# Altium schematic sheet MezzanineDCDC_4646.SchDoc: Mezzanine DCDC PCB LTM4646
size Tabloid; Date: 9/7/2021; Engineer: J. Juneau; Organization: Altium Limited; Address1: L3, 12a Rodborough Rd; Address2: Frenchs Forest; Address3: NSW; Address4: Australia 2086; DocumentNumber: 1006; Revision: 1.2; SheetNumber: 2; SheetTotal: 4
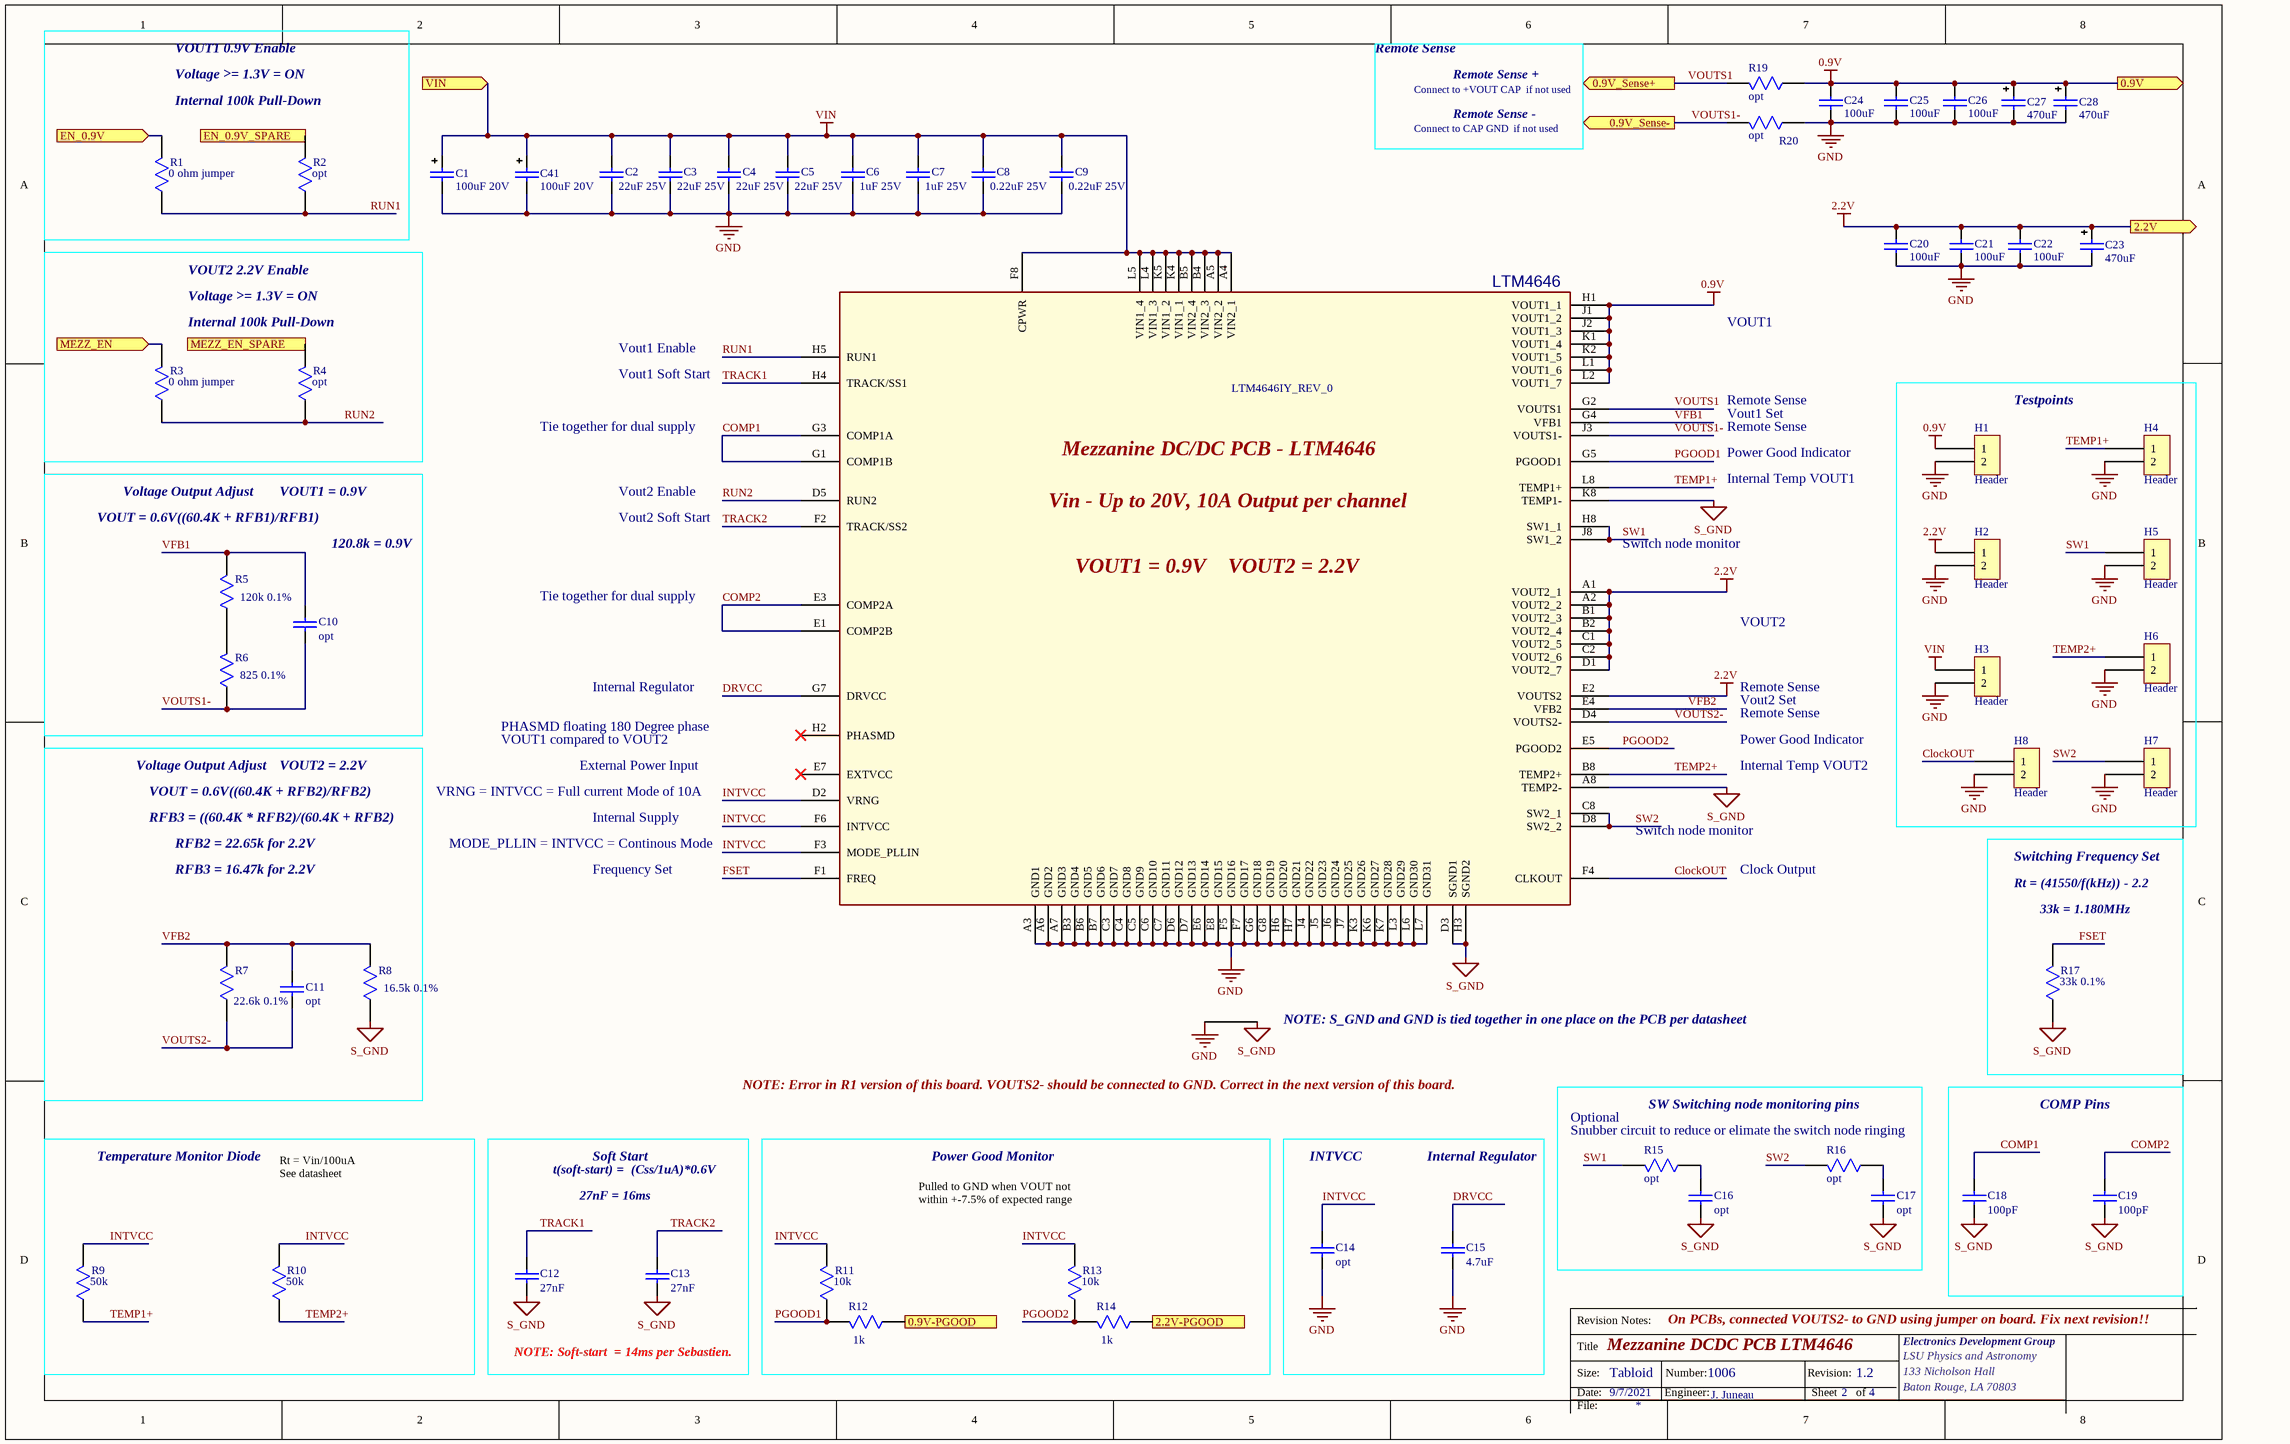
[diagram p0: MezzanineDCDC_4646.SchDoc]

## Parts
C1  value 100uF 20V  [CAP 2917 Tantalum Polarized TAJE107K020RNJ]  (hidden comment: TAJE107K020RNJ)
C2  value 22uF 25V  [CAP 1210 Murata]  (hidden comment: GRM32ER61E226KE15L)
C3  value 22uF 25V  [CAP 1210 Murata]  (hidden comment: GRM32ER61E226KE15L)
C4  value 22uF 25V  [CAP 1210 Murata]  (hidden comment: GRM32ER61E226KE15L)
C5  value 22uF 25V  [CAP 1210 Murata]  (hidden comment: GRM32ER61E226KE15L)
C6  value 1uF 25V  [Cap 0603 TDK]  (hidden comment: GCM188R71E105KA64D)
C7  value 1uF 25V  [Cap 0603 TDK]  (hidden comment: GCM188R71E105KA64D)
C8  value 0.22uF 25V  [Cap 0603 TDK]  (hidden comment: C1608X7R1E224K080AC)
C9  value 0.22uF 25V  [Cap 0603 TDK]  (hidden comment: C1608X7R1E224K080AC)
C10  opt  [Cap 0603 TDK]
C11  opt  [Cap 0603 TDK]
C12  value 27nF  [Cap 0603 TDK]  (hidden comment: 0603YC273KAT2A)
C13  value 27nF  [Cap 0603 TDK]  (hidden comment: 0603YC273KAT2A)
C14  value opt  [Cap 0603 TDK]  (hidden comment: C1608X5R1C475K080AC)
C15  value 4.7uF  [Cap 0603 TDK]  (hidden comment: C1608X5R1C475K080AC)
C16  opt  [Cap 0603 TDK]
C17  opt  [Cap 0603 TDK]
C18  value 100pF  [Cap 0603 TDK]  (hidden comment: 0603YC101KAT2A)
C19  value 100pF  [Cap 0603 TDK]  (hidden comment: 0603YC101KAT2A)
C20  value 100uF  [CAP 1210 Murata]  (hidden comment: GRM32ER60J107ME20K)
C21  value 100uF  [CAP 1210 Murata]  (hidden comment: GRM32ER60J107ME20K)
C22  value 100uF  [CAP 1210 Murata]  (hidden comment: GRM32ER60J107ME20K)
C23  value 470uF  [CAP 2917 Tantalum Polarized]  (hidden comment: 4TPE470MCL)
C24  value 100uF  [CAP 1210 Murata]  (hidden comment: GRM32ER60J107ME20K)
C25  value 100uF  [CAP 1210 Murata]  (hidden comment: GRM32ER60J107ME20K)
C26  value 100uF  [CAP 1210 Murata]  (hidden comment: GRM32ER60J107ME20K)
C27  value 470uF  [CAP 2917 Tantalum Polarized]  (hidden comment: 4TPE470MCL)
C28  value 470uF  [CAP 2917 Tantalum Polarized]  (hidden comment: 4TPE470MCL)
C41  value 100uF 20V  [CAP 2917 Tantalum Polarized TAJE107K020RNJ]  (hidden comment: TAJE107K020RNJ)
H1  Header  [Header 2Pin]
H2  Header  [Header 2Pin]
H3  Header  [Header 2Pin]
H4  Header  [Header 2Pin]
H5  Header  [Header 2Pin]
H6  Header  [Header 2Pin]
H7  Header  [Header 2Pin]
H8  Header  [Header 2Pin]
R1  value 0 ohm jumper  [Resistor ERJ2G/CRCW 0402]  (hidden comment: CRCW04020000ZSTD)
R2  opt  [Resistor ERJ2G/CRCW 0402]
R3  value 0 ohm jumper  [Resistor ERJ2G/CRCW 0402]  (hidden comment: CRCW04020000ZSTD)
R4  opt  [Resistor ERJ2G/CRCW 0402]
R5  value 120k 0.1%  [Resistor 0603 - ERJ]  (hidden comment: ERA-3AEB124V)
R6  value 825 0.1%  [Resistor 0603 - ERJ]  (hidden comment: ERA-3AEB8250V)
R7  value 22.6k 0.1%  [Resistor 0603 - ERJ]  (hidden comment: ERA-3AEB2262V)
R8  value 16.5k 0.1%  [Resistor 0603 - ERJ]  (hidden comment: ERA-3AEB1652V)
R9  value 50k  [Resistor ERJ2G/CRCW 0402]  (hidden comment: ERA-2AEB4992X)
R10  value 50k  [Resistor ERJ2G/CRCW 0402]  (hidden comment: ERA-2AEB4992X)
R11  value 10k  [Resistor ERJ2G/CRCW 0402]  (hidden comment: ERJ-2GEJ103X)
R12  value 1k  [Resistor ERJ2G/CRCW 0402]  (hidden comment: ERJ-2GEJ102X)
R13  value 10k  [Resistor ERJ2G/CRCW 0402]  (hidden comment: ERJ-2GEJ103X)
R14  value 1k  [Resistor ERJ2G/CRCW 0402]  (hidden comment: ERJ-2GEJ102X)
R15  opt  [Resistor ERJ2G/CRCW 0402]
R16  opt  [Resistor ERJ2G/CRCW 0402]
R17  value 33k 0.1%  [Resistor 0603 - ERJ]  (hidden comment: ERA-3AEB333V)
R19  opt  [Resistor ERJ2G/CRCW 0402]
R20  opt  [Resistor ERJ2G/CRCW 0402]
U1  LTM4646IY_REV_0  [LTM4646]  (net tie, no BOM)

## Blocks framed on the sheet
Testpoints: H1-H8
Switching Frequency Set: R17
COMP Pins: C18 C19
Temperature Monitor Diode: R9 R10
Soft Start: C12 C13
Power Good Monitor: R11-R14

## Ports
0.9V (out), 0.9V-PGOOD (out), 0.9V_Sense+ (out), 0.9V_Sense- (out), 2.2V (out), 2.2V-PGOOD (out), EN_0.9V (in), EN_0.9V_SPARE (in), MEZZ_EN (in), MEZZ_EN_SPARE (in), VIN (in)

## Nets
0.9V: C24.1 C25.1 C26.1 C27.1 C28.1 H1.1 R19.1 U1.H1(VOUT1_1) U1.J1(VOUT1_2) U1.J2(VOUT1_3) U1.K1(VOUT1_4) U1.K2(VOUT1_5) U1.L1(VOUT1_6) U1.L2(VOUT1_7) ; port 0.9V
2.2V: C20.1 C21.1 C22.1 C23.1 H2.1 U1.A1(VOUT2_1) U1.A2(VOUT2_2) U1.B1(VOUT2_3) U1.B2(VOUT2_4) U1.C1(VOUT2_5) U1.C2(VOUT2_6) U1.D1(VOUT2_7) U1.E2(VOUTS2) ; port 2.2V
GND: C1.2 C2.2 C3.2 C4.2 C5.2 C6.2 C7.2 C8.2 C9.2 C14.2 C15.2 C20.2 C21.2 C22.2 C23.2 C24.2 C25.2 C26.2 C27.2 C28.2 C41.2 H1.2 H2.2 H3.2 H4.2 H5.2 H6.2 H7.2 H8.2 R20.1 U1.A3(GND1) U1.A6(GND2) U1.A7(GND3) U1.B3(GND4) U1.B6(GND5) U1.B7(GND6) U1.C3(GND7) U1.C4(GND8) U1.C5(GND9) U1.C6(GND10) U1.C7(GND11) U1.D6(GND12) U1.D7(GND13) U1.E6(GND14) U1.E8(GND15) U1.F5(GND16) U1.F7(GND17) U1.G6(GND18) U1.G8(GND19) U1.H6(GND20) U1.H7(GND21) U1.J4(GND22) U1.J5(GND23) U1.J6(GND24) U1.J7(GND25) U1.K3(GND26) U1.K6(GND27) U1.K7(GND28) U1.L3(GND29) U1.L6(GND30) U1.L7(GND31)
S_GND: C12.2 C13.2 C16.2 C17.2 C18.2 C19.2 R8.1 R17.1 U1.A8(TEMP2-) U1.D3(SGND1) U1.H3(SGND2) U1.K8(TEMP1-)
VIN: C1.1 C2.1 C3.1 C4.1 C5.1 C6.1 C7.1 C8.1 C9.1 C41.1 H3.1 U1.A4(VIN2_1) U1.A5(VIN2_2) U1.B4(VIN2_3) U1.B5(VIN2_4) U1.F8(CPWR) U1.K4(VIN1_1) U1.K5(VIN1_2) U1.L4(VIN1_3) U1.L5(VIN1_4) ; port VIN
0.9V-PGOOD: R12.1 ; port 0.9V-PGOOD
2.2V-PGOOD: R14.1 ; port 2.2V-PGOOD
ClockOUT: H8.1 U1.F4(CLKOUT)
COMP1: C18.1 U1.G1(COMP1B) U1.G3(COMP1A)
COMP2: C19.1 U1.E1(COMP2B) U1.E3(COMP2A)
DRVCC: C15.1 U1.G7(DRVCC)
EN_0.9V: R1.2 ; port EN_0.9V
EN_0.9V_SPARE: R2.2 ; port EN_0.9V_SPARE
FSET: R17.2 U1.F1(FREQ)
INTVCC: C14.1 R9.2 R10.2 R11.2 R13.2 U1.D2(VRNG) U1.F3(MODE_PLLIN) U1.F6(INTVCC)
MEZZ_EN: R3.2 ; port MEZZ_EN
MEZZ_EN_SPARE: R4.2 ; port MEZZ_EN_SPARE
PGOOD1: R11.1 R12.2 U1.G5(PGOOD1)
PGOOD2: R13.1 R14.2 U1.E5(PGOOD2)
RUN1: R1.1 R2.1 U1.H5(RUN1)
RUN2: R3.1 R4.1 U1.D5(RUN2)
SW1: H5.1 R15.2 U1.H8(SW1_1) U1.J8(SW1_2)
SW2: H7.1 R16.2 U1.C8(SW2_1) U1.D8(SW2_2)
TEMP1+: H4.1 R9.1 U1.L8(TEMP1+)
TEMP2+: H6.1 R10.1 U1.B8(TEMP2+)
TRACK1: C12.1 U1.H4(TRACK/SS1)
TRACK2: C13.1 U1.F2(TRACK/SS2)
VFB1: C10.1 R5.2 U1.G4(VFB1)
VFB2: C11.1 R7.2 R8.2 U1.E4(VFB2)
VOUTS1: R19.2 U1.G2(VOUTS1) ; port 0.9V_Sense+
VOUTS1-: C10.2 R6.1 R20.2 U1.J3(VOUTS1-) ; port 0.9V_Sense-
VOUTS2-: C11.2 R7.1 U1.D4(VOUTS2-)
NetC16_1: C16.1 R15.1
NetC17_1: C17.1 R16.1
NetR5_1: R5.1 R6.2

Not connected (* = marked no-connect by the designer): U1 E7(EXTVCC)* H2(PHASMD)*

## Notes on the sheet
- VOUT1 0.9V Enable
- Voltage >= 1.3V = ON
- Remote Sense
- Connect to +VOUT CAP  if not used
- Remote Sense +
- Internal 100k Pull-Down
- Connect to CAP GND  if not used
- Remote Sense -
- VOUT2 2.2V Enable
- Vout1 Enable
- VOUT1
- Vout1 Soft Start
- Vout1 Set
- Tie together for dual supply
- (near U1) Mezzanine DC/DC PCB - LTM4646
- Internal Temp VOUT1
- Power Good Indicator
- (near R5) VOUT = 0.6V((60.4K + RFB1)/RFB1)
- Voltage Output Adjust
- VOUT1 = 0.9V
- 120.8k = 0.9V
- Vout2 Enable
- Vout2 Soft Start
- (near U1) Vin - Up to 20V, 10A Output per channel
- Switch node monitor
- (near U1) VOUT1 = 0.9V    VOUT2 = 2.2V
- VOUT2
- PHASMD floating 180 Degree phase
- VOUT1 compared to VOUT2
- Internal Regulator
- Vout2 Set
- VOUT = 0.6V((60.4K + RFB2)/RFB2)
- VOUT2 = 2.2V
- VRNG = INTVCC = Full current Mode of 10A
- External Power Input
- Internal Temp VOUT2
- RFB3 = ((60.4K * RFB2)/(60.4K + RFB2)
- RFB2 = 22.65k for 2.2V
- RFB3 = 16.47k for 2.2V
- MODE_PLLIN = INTVCC = Continous Mode
- Internal Supply
- Frequency Set
- Clock Output
- Rt = (41550/f(kHz)) - 2.2
- (near R17) 33k = 1.180MHz
- NOTE: S_GND and GND is tied together in one place on the PCB per datasheet
- NOTE: Error in R1 version of this board. VOUTS2- should be connected to GND. Correct in the next version of this board.
- Snubber circuit to reduce or elimate the switch node ringing
- (near R15) Optional
- SW Switching node monitoring pins
- Rt = Vin/100uA
  See datasheet
- t(soft-start) =  (Css/1uA)*0.6V
- 27nF = 16ms
- Pulled to GND when VOUT not within +-7.5% of expected range
- INTVCC
- On PCBs, connected VOUTS2- to GND using jumper on board. Fix next revision!!
- NOTE: Soft-start  = 14ms per Sebastien.
- Labels drawn without touching a wire or pin: GND, S_GND
- Revision Notes:
- Title
- Size:
- Date:
- Tabloid
- Engineer:
- Number:
- Revision:
- Sheet
- of
- Electronics Development Group
- LSU Physics and Astronomy
- 133 Nicholson Hall
- Baton Rouge, LA 70803
- File:
- (in symbol LTM4646IY 05-11-0399) LTM4646

## Library data of the parts
C1 C41 = Capacitor 2917 TAJE107K020RNJ: 100µF Molded Tantalum Capacitors 20V 2917 (7343 Metric) 400mOhm; ComponentLink1Description: Digikey; ComponentLink1URL: https://www.digikey.com/en/products/detail/avx-corporation/TAJE107K020RNJ/563850
C2-C5 = Capacitor 1210: 22µF ±10% 25V Ceramic Capacitor X5R 1210 (3225 Metric); ComponentLink1Description: Digikey; ComponentLink1URL: https://www.digikey.com/en/products/detail/murata-electronics/GRM32ER61E226KE15L/965903?s=N4IgTCBcDaIOICUCyBmMBRBA2AjOsYWA0ujgKwAyIAugL5A
C6 C7 = Capacitor 0603 TDK: 1µF ±10% 25V Ceramic Capacitor X7R 0603 (1608 Metric); ComponentLink1Description: Digikey; ComponentLink1URL: https://www.digikey.com/en/products/detail/murata-electronics/GCM188R71E105KA64D/4903956?s=N4IgTCBcDaIOIGECyBGAHGgSgdhQURQAYBWAaQEEA2AFgBEQBdAXyA
C8 C9 = Capacitor 0603 TDK: CAP CER 0.22UF 25V X7R 0603; ComponentLink1Description: Digikey; ComponentLink1URL: https://www.digikey.com/en/products/detail/tdk-corporation/C1608X7R1E224K080AC/1788457?s=N4IgTCBcDaIMIEYBsAGAHADQOwCUEFEwwAWAaXRQEE4QBdAXyA
C10 C11 C16 C17 = Capacitor 0603 TDK: Capacitor 0603; Value: opt
C12 C13 = Capacitor 0603 TDK: 0.027µF ±10% 16V Ceramic Capacitor X7R 0603 (1608 Metric) /; ComponentLink1Description: Digikey; ComponentLink1URL: https://www.digikey.com/en/products/detail/avx-corporation/0603YC273KAT2A/1600569
  C13: Dimensions: *
C14 C15 = Capacitor 0603 TDK: CAP CER 4.7UF 16V X5R 0603; ComponentLink1Description: Digikey; ComponentLink1URL: https://www.digikey.com/en/products/detail/tdk-corporation/C1608X5R1C475K080AC/2732913?s=N4IgTCBcDaIMIEYBsAGAHADQKwCUFwBYB2LAaXRQEE4QBdAXyA
C18 C19 = Capacitor 0603 TDK: 100pF ±10% 16V Ceramic Capacitor X7R 0603 (1608 Metric) /; ComponentLink1Description: Digikey; ComponentLink1URL: https://www.digikey.com/en/products/detail/avx-corporation/0603YC101KAT2A/1600476
  C18: Dimensions: 1.6x0.81x0.9mm
C20-C22 C24-C26 = Capacitor 1210: 100µF ±20% 6.3V Ceramic Capacitor X5R 1210 (3225 Metric); Dimensions: 3.2x2.5x2.7mm; ComponentLink1Description: Digikey; ComponentLink1URL: https://www.digikey.com/en/products/detail/murata-electronics/GRM32ER60J107ME20K/2548458?s=N4IgTCBcDaIOICUCyBmMBRBA2ADAKQEYcB2JdMHAaRAF0BfIA
C23 C27 C28 = Capacitor 2917 Panasonic: 470µF Molded Tantalum Polymer Capacitor 4V 2917 (7343 Metric) 12mOhm @ 100kHz; ComponentLink1Description: Digikey; ComponentLink1URL: https://www.digikey.com/en/products/detail/panasonic-electronic-components/4TPE470MCL/4146614?s=N4IgTCBcDaICwBUAKBROB2ADAWQMIBkQBdAXyA
H1-H8 = Header - 2Pin: Connector Header Through Hole 2 position 0.100" (2.54mm); ComponentLink1Description: Digikey; ComponentLink1URL: https://www.digikey.com/en/products/detail/amphenol-icc-fci/68001-202HLF/2023308
R1 R3 = ERJ2G Resistor 0402: Jumper 0.063W, 1/16W Chip Resistor 0402 (1005 Metric) Automotive AEC-Q200 Thick Film; ComponentLink1Description: Digikey; ComponentLink1URL: https://www.digikey.com/en/products/detail/vishay-dale/CRCW04020000ZSTD/1226552
R2 R4 R15 R16 R19 R20 = ERJ2G Resistor 0402: Resistor 0402; Value: opt
R5 = Resistor 0603: 120 kOhms ±0.1% 0.1W, 1/10W Chip Resistor 0603 (1608 Metric) Automotive AEC-Q200 Thin Film; ComponentLink1Description: Digikey; ComponentLink1URL: https://www.digikey.com/en/products/detail/panasonic-electronic-components/ERA-3AEB124V/1465904
R6 = Resistor 0603: RES SMD 825 OHM 0.1% 1/10W 0603; ComponentLink1Description: Digikey; ComponentLink1URL: https://www.digikey.com/en/products/detail/panasonic-electronic-components/ERA-3AEB8250V/2026741?s=N4IgTCBcDaIKICUCCBaAzEuAhAHGArAAwBqIAugL5A
R7 = Resistor 0603: 22.6 kOhms ±0.1% 0.1W, 1/10W Chip Resistor 0603 (1608 Metric) Automotive AEC-Q200 Thin Film; ComponentLink1Description: Digikey; ComponentLink1URL: https://www.digikey.com/en/products/detail/panasonic-electronic-components/ERA-3AEB2262V/2026868?s=N4IgjCBcoMxaBjKAzAhgGwM4FMA0IB7KAbRAHYYIBdfABwBcoQBlegJwEsA7AcxAF98YAGzwQSSGix5CJEDACcAJgAsomiAZNWnXgKEKAHArESpOfEUikADCA1bILdtz6CQSm4YCsplBgtZaw8lADphAAIAawB5AAsAW0x7OkYnAFUuDnoY5ABZbFRMAFc2bH0QAFolP0h2YpkrUl8HNJAKypVa80a5MENhBRbUpgF%2BfiA
R8 = Resistor 0603: 16.5 kOhms ±0.1% 0.1W, 1/10W Chip Resistor 0603 (1608 Metric) Automotive AEC-Q200 Thin Film; ComponentLink1Description: Digikey; ComponentLink1URL: https://www.digikey.com/en/products/detail/panasonic-electronic-components/ERA-3AEB1652V/2026856
R9 R10 = ERJ2G Resistor 0402: 49.9 ±0.1% 0.063W, 1/16W Chip Resistor 0402 (1005 Metric) Automotive AEC-Q200 Thin Film; ComponentLink1Description: Digikey; ComponentLink1URL: https://www.digikey.com/en/products/detail/panasonic-electronic-components/ERA-2AEB4992X/2026206?s=N4IgjCBcoMxaBjKAzAhgGwM4FMA0IB7KAbRAHYYIBdfABwBcoQBlegJwEsA7AcxAF98YAGzwQSSGix5CJEDACcYAKwAOEDRAMmrTrwH4ATAAZVysRKk58RSKQAsCgHQKABAGsA8gAsAtpg06RkgQAFUuDnpPZABZbFRMAFc2bAMQAFpDCyh2RJlbUnNNbRC09PtsyQxrWTtwVWEFCuLgkAF%2BfiA
R11 R13 = ERJ2G Resistor 0402: RES SMD 10K OHM 5% 1/10W 0402; ComponentLink1Description: Digikey; ComponentLink1URL: https://www.digikey.com/en/products/detail/panasonic-electronic-components/ERJ-2GEJ103X/146735?s=N4IgTCBcDaIKICUBSBaMBxOSCMAGAzABogC6AvkA
R12 R14 = ERJ2G Resistor 0402: RES SMD 1K OHM 5% 1/10W 0402; ComponentLink1Description: Digikey; ComponentLink1URL: https://www.digikey.com/en/products/detail/panasonic-electronic-components/ERJ-2GEJ102X/146898?s=N4IgTCBcDaIKICUBSBaMBxOSCMAGMAGiALoC%2BQA
R17 = Resistor 0603: 33 ±0.1% 0.1W, 1/10W Chip Resistor 0603 (1608 Metric) Automotive AEC-Q200 Thin Film; ComponentLink1Description: Digikey; ComponentLink1URL: https://www.digikey.com/en/products/detail/panasonic-electronic-components/ERA-3AEB333V/1465890
U1 = LTM4646IY 05-11-0399